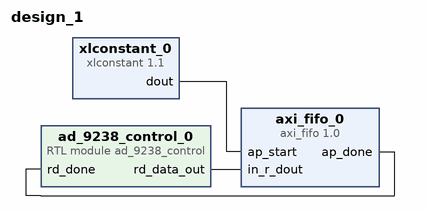
[diagram p0: block diagram of the top level]
# Vivado block design design_1, xczu3eg-sfvc784-1-i, Vivado 2020.1
create_bd_design design_1

create_bd_cell -type ip -vlnv xilinx.com:hls:axi_fifo:1.0 axi_fifo_0
create_bd_cell -type ip -vlnv xilinx.com:ip:xlconstant:1.1 xlconstant_0
create_bd_cell -type module -reference ad_9238_control ad_9238_control_0

# ---- connections ----

connect_bd_net [get_bd_pins xlconstant_0/dout] [get_bd_pins axi_fifo_0/ap_start]
connect_bd_net [get_bd_pins axi_fifo_0/ap_done] [get_bd_pins ad_9238_control_0/rd_done]
connect_bd_net [get_bd_pins ad_9238_control_0/rd_data_out] [get_bd_pins axi_fifo_0/in_r_dout]

validate_bd_design
save_bd_design
